# EAGLE schematic Hockey Table (EAGLE 7.3.0)
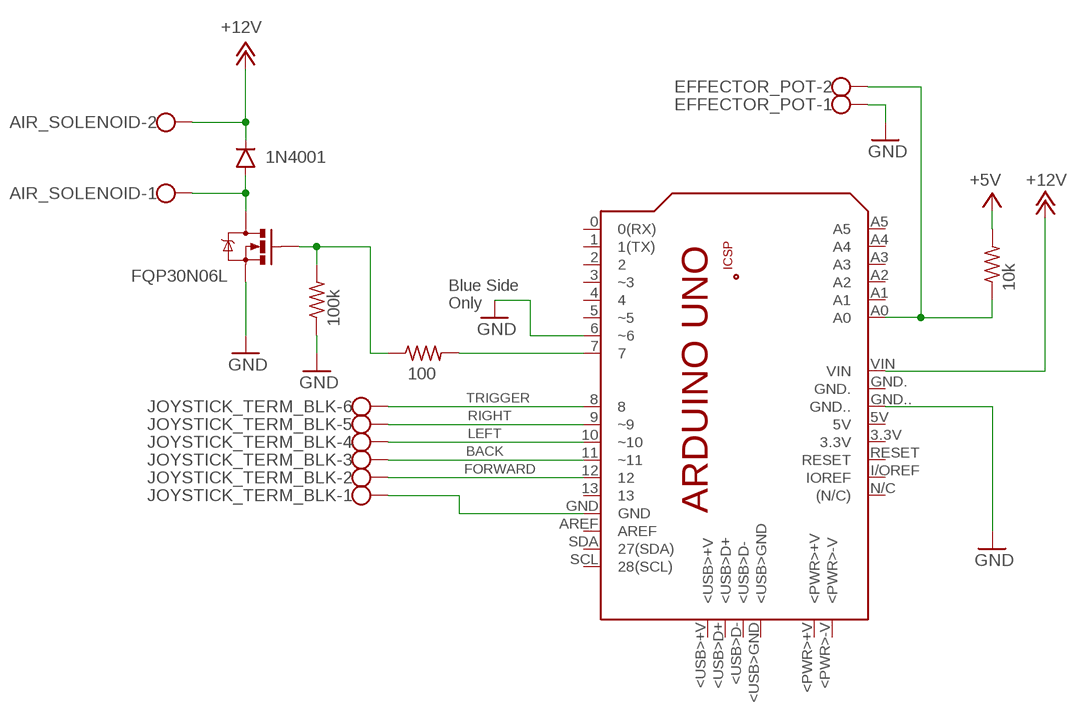
[diagram p0: schematic, sheet 1]

## Parts
AIR_SOLENOID  TERMBLK_SCREW_2RIGHT  [TERMBLK_SCREW_2]
D1  1N4001  DIODE1N4148  [DIODE-1N4148]
EFFECTOR_POT  TERMBLK_SCREW_2RIGHT  [TERMBLK_SCREW_2]
JOYSTICK_TERM_BLK  TERMBLK_SCREW_6RIGHT  [TERMBLK_SCREW_6]
PCB1  ARDUINO_UNO  [ARDUINO_UNO]
Q1  FQP30N06L  MOSFET-NCHANNELFQP30N06L  [TO220V]
R1  10k  R-US_0207/10  [0207/10]
R2  100k  R-US_0207/10  [0207/10]
R3  100  R-US_0207/10  [0207/10]

## Nets
+5V: R1.2
+12V: AIR_SOLENOID.2 D1.C PCB1.VIN
BACK: JOYSTICK_TERM_BLK.3 PCB1.11(~11)
FORWARD: JOYSTICK_TERM_BLK.2 PCB1.12
GND: EFFECTOR_POT.1 PCB1.6(~6) PCB1.GND.. Q1.3(S) R2.1
LEFT: JOYSTICK_TERM_BLK.4 PCB1.10(~10)
N$1: JOYSTICK_TERM_BLK.1 PCB1.GND
N$7: EFFECTOR_POT.2 PCB1.A0 R1.1
N$8: AIR_SOLENOID.1 D1.A Q1.2(D)
N$9: Q1.1(G) R2.2 R3.1
N$10: PCB1.7 R3.2
RIGHT: JOYSTICK_TERM_BLK.5 PCB1.9(~9)
TRIGGER: JOYSTICK_TERM_BLK.6 PCB1.8
Unconnected: PCB1.0(0(RX)) PCB1.1(1(TX)) PCB1.2 PCB1.3(~3) PCB1.3.3V PCB1.4 PCB1.5(~5) PCB1.5V PCB1.13 PCB1.+5V PCB1.<PWR>+V PCB1.<PWR>-V PCB1.<USB>+V PCB1.<USB>D+ PCB1.<USB>D- PCB1.<USB>GND PCB1.A1 PCB1.A2 PCB1.A3 PCB1.A4 PCB1.A5 PCB1.AREF PCB1.GND. PCB1.GND_ PCB1.I/OREF(IOREF) PCB1.MISO PCB1.MOSI PCB1.N/C((N/C)) PCB1.RESET PCB1.RESET. PCB1.SCK PCB1.SCL(28(SCL)) PCB1.SDA(27(SDA))

## Notes on the sheet
- Blue Side 
  Only

## Library data of the parts
AIR_SOLENOID EFFECTOR_POT = SRG:TERMBLK_SCREW_2: Screw Terminal Block 2-pin, side entry Pheonix 282834-2 Digikey A98333-ND 0.1" (2.54mm) Pitch; DIGIKEY: A98333
D1 = SparkFun-DiscreteSemi:DIODE: Diode These are standard reverse protection diodes and small signal diodes. SMA package can handle up to about 1A. SOD-323 can handle about 200mA. What the SOD-323 package when ordering, there are some mfgs out there that are 5-pin packages.
JOYSTICK_TERM_BLK = SRG:TERMBLK_SCREW_6: Screw Terminal Block 6-pin, side entry Pheonix 282834-6 Digikey A98337-ND 0.1" (2.54mm) Pitch; DIGIKEY: A98337
PCB1 = Arduino:ARDUINO_UNO: Device for representing an Arduino Uno board with a footprint in an EAGLE design. Created by Dave Young for Element14. More EAGLE documentation at: http://www.element14.com/community/community/knode/cadsoft_eagle
Q1 = SparkFun-DiscreteSemi:MOSFET-NCHANNEL: Common NMOSFET Parts MFG P/N Store ID Prod ID FDD8780 TRANS-09984 SI7820DN TRANS-11055 FDS6630A IC-08089 2N7002PW TRANS-11151 FQP30N06L COM-10213 TRANS-10060 BSS123LT1G TRANS-08345 BSS138 TRANS-00830 BS170 2N7000; PROD_ID: TRANS-10060
R1-R3 = rcl:R-US_: RESISTOR, American symbol